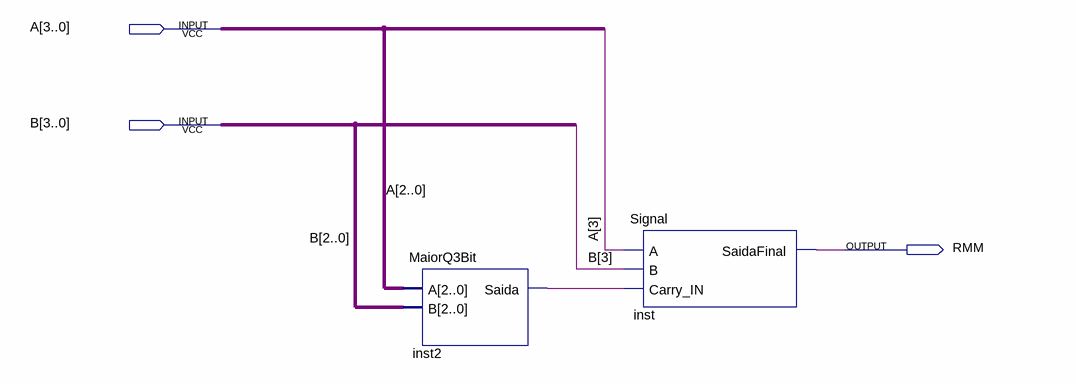
[diagram p0: schematic sheet]
// Quartus schematic Maior_Menor.bdf as structural Verilog: 2 symbols, 3 pins
module Maior_Menor (
  input  [3:0] A,
  input  [3:0] B,
  output RMM
);

  wire inst2_saida;

  MaiorQ3Bit inst2 (.A(A[2:0]), .B(B[2:0]), .Saida(inst2_saida));
  Signal inst (.A(A[3]), .Carry_IN(inst2_saida), .B(B[3]), .SaidaFinal(RMM));
endmodule
